# Altium schematic sheet 3_PWR.schdoc
size 431 x 309 mm; Symbol: Sheet-Symbol_A4; Device: Sheet-Symbol_A4; Company: 嘉立创EDA; Version: V1.0; Page Size: A4; @Project Name: RK3568核心板; @Page Count: 13; @Update Date: 2024-10-10; @Create Date: 2024-10-08; @Schematic Name: Schematic1; @Page No: 2; @Page Name: PWR; @Board Name: Board1; @Create Time: 17:08:18; @Update Time: 11:30:42; Width: 1655; Height: 1170; Region Start: 1; X Region Count: 6; Y Region Count: 4; Blade Width: 10; Title Block Position: 3
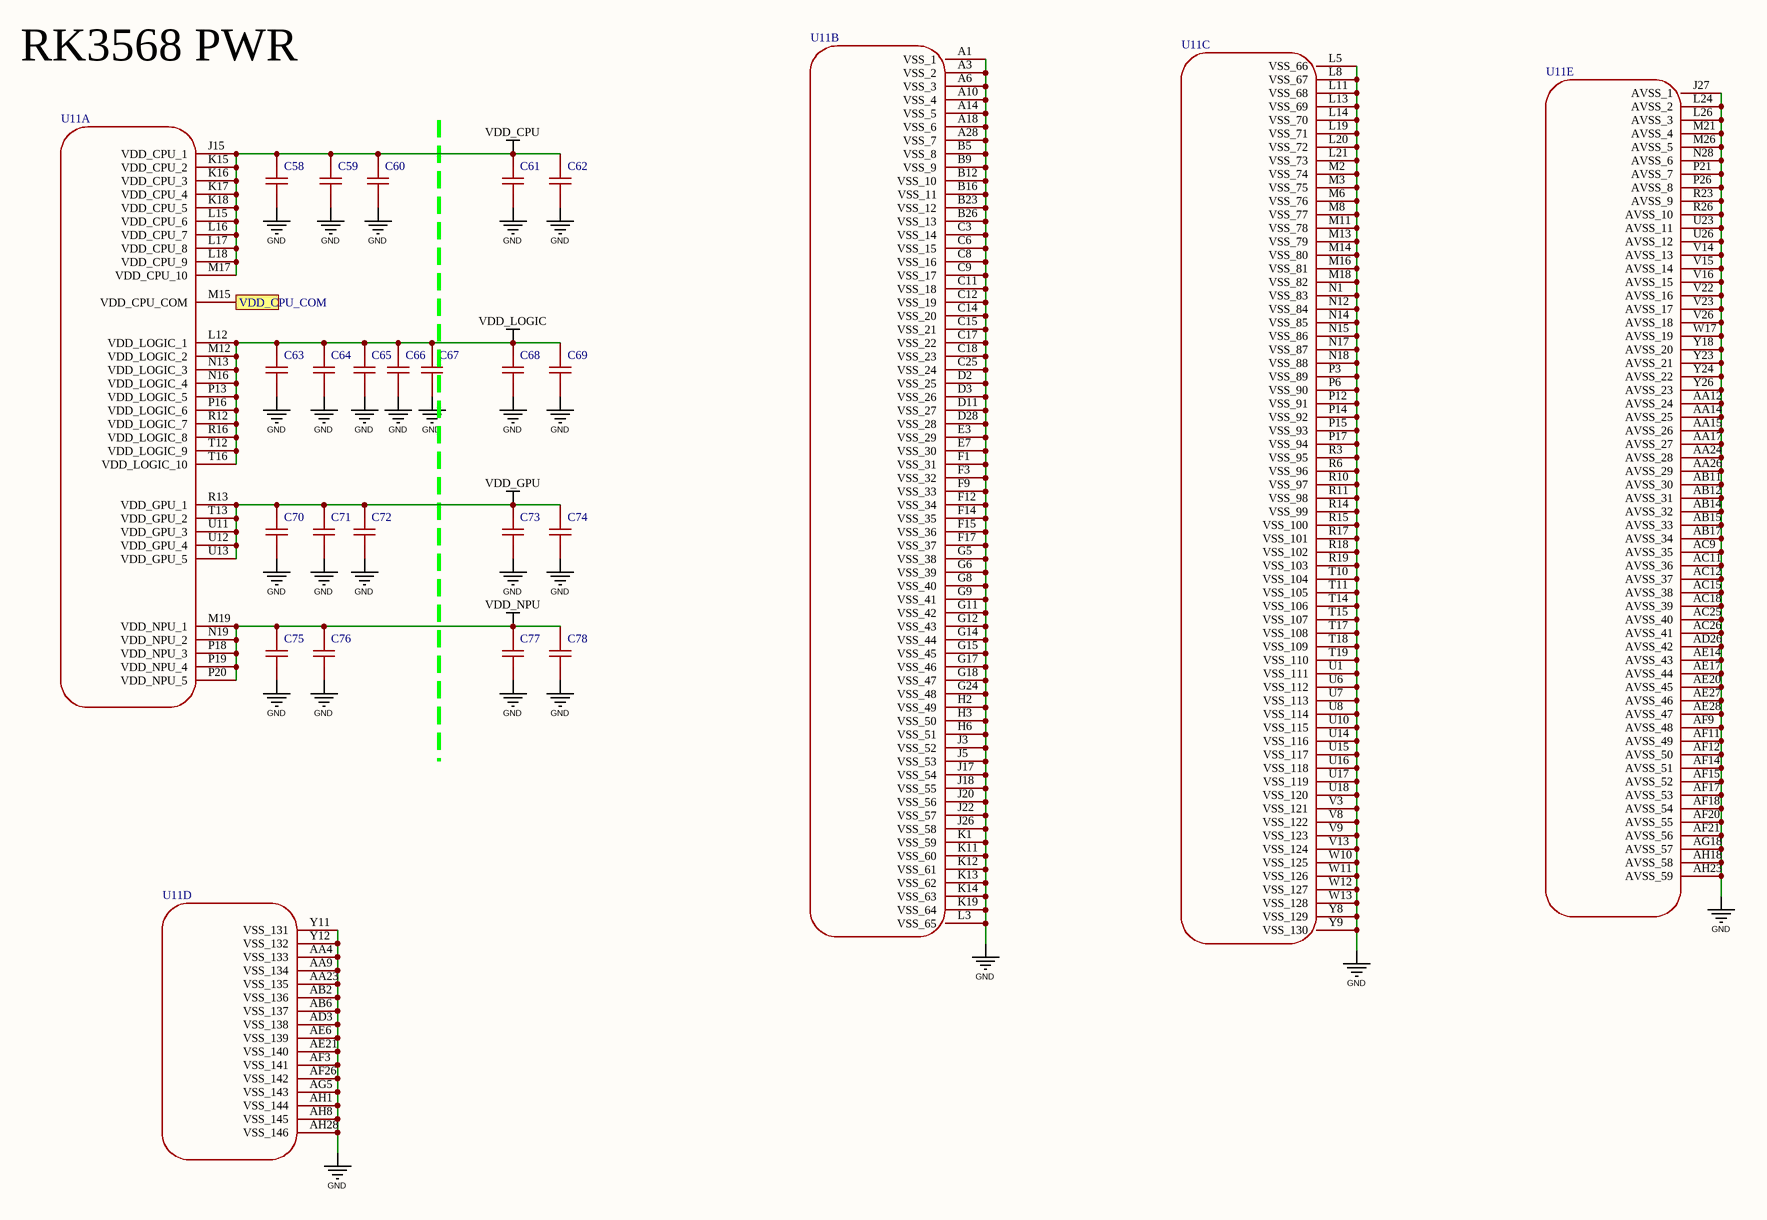
[diagram p0: 3_PWR.schdoc]

## Parts
C58  100nF  [C0201]  (value not drawn)
C59  1uF  [C0402]  (value not drawn)
C60  22uF  [C0603]  (value not drawn)
C61  22uF  [C0603]  (value not drawn)
C62  22uF  [C0603]  (value not drawn)
C63  100nF  [C0201]  (value not drawn)
C64  4.7uF  [C0201]  (value not drawn)
C65  1uF  [C0402]  (value not drawn)
C66  1uF  [C0402]  (value not drawn)
C67  22uF  [C0603]  (value not drawn)
C68  22uF  [C0603]  (value not drawn)
C69  10uF  [C0402]  (value not drawn)
C70  100nF  [C0201]  (value not drawn)
C71  4.7uF  [C0201]  (value not drawn)
C72  22uF  [C0603]  (value not drawn)
C73  22uF  [C0603]  (value not drawn)
C74  10uF  [C0402]  (value not drawn)
C75  100nF  [C0201]  (value not drawn)
C76  22uF  [C0603]  (value not drawn)
C77  22uF  [C0603]  (value not drawn)
C78  10uF  [C0402]  (value not drawn)
U11  SOC_RK3568  [RK3568]  (value not drawn)  (parts A,B,C,D,E of 23)

## Ports
VDD_CPU_COM (out)

## Nets
GND: C58.1 C59.1 C60.1 C61.1 C62.1 C63.1 C64.1 C65.1 C66.1 C67.1 C68.1 C69.1 C70.1 C71.1 C72.1 C73.1 C74.1 C75.1 C76.1 C77.1 C78.1 U11.A1(VSS_1) U11.A3(VSS_2) U11.A6(VSS_3) U11.A10(VSS_4) U11.A14(VSS_5) U11.A18(VSS_6) U11.A28(VSS_7) U11.AA4(VSS_133) U11.AA9(VSS_134) U11.AA12(AVSS_24) U11.AA14(AVSS_25) U11.AA15(AVSS_26) U11.AA17(AVSS_27) U11.AA23(VSS_135) U11.AA24(AVSS_28) U11.AA26(AVSS_29) U11.AB2(VSS_136) U11.AB6(VSS_137) U11.AB11(AVSS_30) U11.AB12(AVSS_31) U11.AB14(AVSS_32) U11.AB15(AVSS_33) U11.AB17(AVSS_34) U11.AC9(AVSS_35) U11.AC11(AVSS_36) U11.AC12(AVSS_37) U11.AC15(AVSS_38) U11.AC18(AVSS_39) U11.AC25(AVSS_40) U11.AC26(AVSS_41) U11.AD3(VSS_138) U11.AD26(AVSS_42) U11.AE6(VSS_139) U11.AE14(AVSS_43) U11.AE17(AVSS_44) U11.AE20(AVSS_45) U11.AE21(VSS_140) U11.AE27(AVSS_46) U11.AE28(AVSS_47) U11.AF3(VSS_141) U11.AF9(AVSS_48) U11.AF11(AVSS_49) U11.AF12(AVSS_50) U11.AF14(AVSS_51) U11.AF15(AVSS_52) U11.AF17(AVSS_53) U11.AF18(AVSS_54) U11.AF20(AVSS_55) U11.AF21(AVSS_56) U11.AF26(VSS_142) U11.AG5(VSS_143) U11.AG18(AVSS_57) U11.AH1(VSS_144) U11.AH8(VSS_145) U11.AH18(AVSS_58) U11.AH23(AVSS_59) U11.AH28(VSS_146) U11.B5(VSS_8) U11.B9(VSS_9) U11.B12(VSS_10) U11.B16(VSS_11) U11.B23(VSS_12) U11.B26(VSS_13) U11.C3(VSS_14) U11.C6(VSS_15) U11.C8(VSS_16) U11.C9(VSS_17) U11.C11(VSS_18) U11.C12(VSS_19) U11.C14(VSS_20) U11.C15(VSS_21) U11.C17(VSS_22) U11.C18(VSS_23) U11.C25(VSS_24) U11.D2(VSS_25) U11.D3(VSS_26) U11.D11(VSS_27) U11.D28(VSS_28) U11.E3(VSS_29) U11.E7(VSS_30) U11.F1(VSS_31) U11.F3(VSS_32) U11.F9(VSS_33) U11.F12(VSS_34) U11.F14(VSS_35) U11.F15(VSS_36) U11.F17(VSS_37) U11.G5(VSS_38) U11.G6(VSS_39) U11.G8(VSS_40) U11.G9(VSS_41) U11.G11(VSS_42) U11.G12(VSS_43) U11.G14(VSS_44) U11.G15(VSS_45) U11.G17(VSS_46) U11.G18(VSS_47) U11.G24(VSS_48) U11.H2(VSS_49) U11.H3(VSS_50) U11.H6(VSS_51) U11.J3(VSS_52) U11.J5(VSS_53) U11.J17(VSS_54) U11.J18(VSS_55) U11.J20(VSS_56) U11.J22(VSS_57) U11.J26(VSS_58) U11.J27(AVSS_1) U11.K1(VSS_59) U11.K11(VSS_60) U11.K12(VSS_61) U11.K13(VSS_62) U11.K14(VSS_63) U11.K19(VSS_64) U11.L3(VSS_65) U11.L5(VSS_66) U11.L8(VSS_67) U11.L11(VSS_68) U11.L13(VSS_69) U11.L14(VSS_70) U11.L19(VSS_71) U11.L20(VSS_72) U11.L21(VSS_73) U11.L24(AVSS_2) U11.L26(AVSS_3) U11.M2(VSS_74) U11.M3(VSS_75) U11.M6(VSS_76) U11.M8(VSS_77) U11.M11(VSS_78) U11.M13(VSS_79) U11.M14(VSS_80) U11.M16(VSS_81) U11.M18(VSS_82) U11.M21(AVSS_4) U11.M26(AVSS_5) U11.N1(VSS_83) U11.N12(VSS_84) U11.N14(VSS_85) U11.N15(VSS_86) U11.N17(VSS_87) U11.N18(VSS_88) U11.N28(AVSS_6) U11.P3(VSS_89) U11.P6(VSS_90) U11.P12(VSS_91) U11.P14(VSS_92) U11.P15(VSS_93) U11.P17(VSS_94) U11.P21(AVSS_7) U11.P26(AVSS_8) U11.R3(VSS_95) U11.R6(VSS_96) U11.R10(VSS_97) U11.R11(VSS_98) U11.R14(VSS_99) U11.R15(VSS_100) U11.R17(VSS_101) U11.R18(VSS_102) U11.R19(VSS_103) U11.R23(AVSS_9) U11.R26(AVSS_10) U11.T10(VSS_104) U11.T11(VSS_105) U11.T14(VSS_106) U11.T15(VSS_107) U11.T17(VSS_108) U11.T18(VSS_109) U11.T19(VSS_110) U11.U1(VSS_111) U11.U6(VSS_112) U11.U7(VSS_113) U11.U8(VSS_114) U11.U10(VSS_115) U11.U14(VSS_116) U11.U15(VSS_117) U11.U16(VSS_118) U11.U17(VSS_119) U11.U18(VSS_120) U11.U23(AVSS_11) U11.U26(AVSS_12) U11.V3(VSS_121) U11.V8(VSS_122) U11.V9(VSS_123) U11.V13(VSS_124) U11.V14(AVSS_13) U11.V15(AVSS_14) U11.V16(AVSS_15) U11.V22(AVSS_16) U11.V23(AVSS_17) U11.V26(AVSS_18) U11.W10(VSS_125) U11.W11(VSS_126) U11.W12(VSS_127) U11.W13(VSS_128) U11.W17(AVSS_19) U11.Y8(VSS_129) U11.Y9(VSS_130) U11.Y11(VSS_131) U11.Y12(VSS_132) U11.Y18(AVSS_20) U11.Y23(AVSS_21) U11.Y24(AVSS_22) U11.Y26(AVSS_23)
VDD_CPU: C58.2 C59.2 C60.2 C61.2 C62.2 U11.J15(VDD_CPU_1) U11.K15(VDD_CPU_2) U11.K16(VDD_CPU_3) U11.K17(VDD_CPU_4) U11.K18(VDD_CPU_5) U11.L15(VDD_CPU_6) U11.L16(VDD_CPU_7) U11.L17(VDD_CPU_8) U11.L18(VDD_CPU_9) U11.M17(VDD_CPU_10)
VDD_GPU: C70.2 C71.2 C72.2 C73.2 C74.2 U11.R13(VDD_GPU_1) U11.T13(VDD_GPU_2) U11.U11(VDD_GPU_3) U11.U12(VDD_GPU_4) U11.U13(VDD_GPU_5)
VDD_LOGIC: C63.2 C64.2 C65.2 C66.2 C67.2 C68.2 C69.2 U11.L12(VDD_LOGIC_1) U11.M12(VDD_LOGIC_2) U11.N13(VDD_LOGIC_3) U11.N16(VDD_LOGIC_4) U11.P13(VDD_LOGIC_5) U11.P16(VDD_LOGIC_6) U11.R12(VDD_LOGIC_7) U11.R16(VDD_LOGIC_8) U11.T12(VDD_LOGIC_9) U11.T16(VDD_LOGIC_10)
VDD_NPU: C75.2 C76.2 C77.2 C78.2 U11.M19(VDD_NPU_1) U11.N19(VDD_NPU_2) U11.P18(VDD_NPU_3) U11.P19(VDD_NPU_4) U11.P20(VDD_NPU_5)
VDD_CPU_COM: U11.M15(VDD_CPU_COM) ; port VDD_CPU_COM

## Notes on the sheet
- RK3568 PWR
- 1
- 2
- 3
- 4
- 5
- 6
- A
- B
- C
- D
- 原理图
- Schematic1
- 创建日期
- 更新日期
- 2024-10-10
- 2024-10-08
- 审阅
- 绘制
- 图页
- PWR
- 物料编码
- RK3568核心板
- 版本
- 尺寸
- 页
- 共
- 13
- V1.0
- A4
- 嘉立创EDA

## Library data of the parts
C58 C63 C70 C75 = CL03A104KO3NNNC: 容值:100nF;精度:±10%;额定电压:16V;材质(温度系数):X5R;; Manufacturer: SAMSUNG(三星); Add into BOM: yes; Tolerance: ±10%; Voltage Rated: 16V; Temperature Coefficient: X5R; Symbol: CL03A104KO3NNNC; Device: CL03A104KO3NNNC; LCSC Part Name: 100nF ±10% 16V; Supplier Part: C307380; Manufacturer Part: CL03A104KO3NNNC; Supplier Footprint: 0201; JLCPCB Part Class: 扩展库; Datasheet: https://atta.szlcsc.com/upload/public/pdf/source/20160218/1457707763339.pdf; Supplier: LCSC; Convert to PCB: yes; Value: 100nF
C59 C65 C66 = CL05A105KA5NQNC: 容值:1uF;精度:±10%;额定电压:25V;材质(温度系数):X5R;; Manufacturer: SAMSUNG(三星); Add into BOM: yes; Tolerance: ±10%; Voltage Rated: 25V; Temperature Coefficient: X5R; Symbol: CL05A105KA5NQNC; Device: CL05A105KA5NQNC; LCSC Part Name: 1uF ±10% 25V; Supplier Part: C52923; Manufacturer Part: CL05A105KA5NQNC; Supplier Footprint: 0402; JLCPCB Part Class: 基础库; Datasheet: https://atta.szlcsc.com/upload/public/pdf/source/20160218/1457707763339.pdf; Supplier: LCSC; Convert to PCB: yes; Value: 1uF
C60-C62 C67 C68 C72 C73 C76 C77 = CL10A226MP8NUNE: 容值:22uF;精度:±20%;额定电压:10V;材质(温度系数):X5R;; Manufacturer: SAMSUNG(三星); Add into BOM: yes; Tolerance: ±20%; Voltage Rated: 10V; Temperature Coefficient: X5R; Symbol: CL10A226MP8NUNE; Device: CL10A226MP8NUNE; LCSC Part Name: 22uF ±20% 10V; Supplier Part: C86295; Manufacturer Part: CL10A226MP8NUNE; Supplier Footprint: 0603; JLCPCB Part Class: 扩展库; Datasheet: https://atta.szlcsc.com/upload/public/pdf/source/20160218/1457707763339.pdf; Supplier: LCSC; Convert to PCB: yes; Value: 22uF
C64 C71 = GRM035R60J475ME15D: 容值:4.7uF;精度:±20%;额定电压:6.3V;材质(温度系数):X5R;; Manufacturer: muRata(村田); Add into BOM: yes; Tolerance: ±20%; Voltage Rated: 6.3V; Temperature Coefficient: X5R; Symbol: GRM035R60J475ME15D; Device: GRM035R60J475ME15D; LCSC Part Name: 4.7uF ±20% 6.3V; Supplier Part: C335103; Manufacturer Part: GRM035R60J475ME15D; Supplier Footprint: 0201; JLCPCB Part Class: 扩展库; Datasheet: https://atta.szlcsc.com/upload/public/pdf/source/20200305/C490387_23319AE8C154DEB24C505E6C82A8106A.pdf; Supplier: LCSC; Convert to PCB: yes; Value: 4.7uF
C69 C74 C78 = CL05A106MP5NUNC: 容值:10uF;精度:±20%;额定电压:10V;材质(温度系数):X5R;; Manufacturer: SAMSUNG(三星); Symbol: CL05A106MP5NUNC_C315248; Add into BOM: yes; Tolerance: ±20%; Voltage Rated: 10V; Temperature Coefficient: X5R; Device: CL05A106MP5NUNC; LCSC Part Name: 10uF ±20% 10V; Supplier Part: C315248; Manufacturer Part: CL05A106MP5NUNC; Supplier Footprint: 0402; JLCPCB Part Class: 扩展库; Datasheet: https://atta.szlcsc.com/upload/public/pdf/source/20231220/1EF805BAE1520675928CC4638D279E74.pdf; Supplier: LCSC; Convert to PCB: yes; Value: 10uF
U11 = SOC_RK3568: Part Reference: U1000; Manufacturer: Rockchip (瑞芯微); PCB footprint: BGA636_19R00X19R00X1R20; SWAP_INFO: (S1+S2+S3+S4+S5+S6+S7+S8+S9+S10+S11+S12+S13+S14+S15+S16+S17+S18+S19+S20+S21+S22+S23); SPLIT_INST: TRUE; Value: RK3568; Priority: A; Add into BOM: yes; Relevance: []; Symbol: SOC_RK3568; Device: SOC_RK3568; RK PN: RK3568; Part Type: SOC; Manufacturer PN: RK3568; Created by: JJJ; Origin Footprint 2: BGA636_19R00X19R00X1R20; Convert to PCB: yes